# Altium schematic sheet flyback_circuit.SchDoc
size A
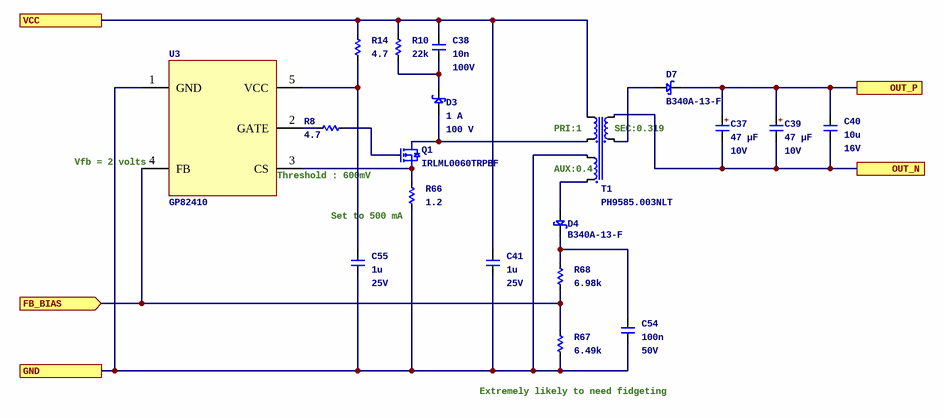
[diagram p0: flyback_circuit.SchDoc]

## Parts
C37  Capacitance: 47 µF  Voltage: 10V  [TANT_3.5MMX2.8MMX1.9MM]  (hidden comment: TAJB476M010RNJ)
C38  Capacitance: 10n  Voltage Rating: 100V  [C0603]  (hidden comment: CGA3EAC0G2A103JT000E)
C39  Capacitance: 47 µF  Voltage: 10V  [TANT_3.5MMX2.8MMX1.9MM]  (hidden comment: TAJB476M010RNJ)
C40  Capacitance: 10u  Voltage Rating: 16V  [C1206]  (hidden comment: CL31B106KOHNNNE)
C41  Capacitance: 1u  Voltage Rating: 25V  [C0603]  (hidden comment: CL10B105KA8NNNC)
C54  Capacitance: 100n  Voltage Rating: 50V  [C0402]  (hidden comment: CL05B104KB54PNC)
C55  Capacitance: 1u  Voltage Rating: 25V  [C0603]  (hidden comment: CL10B105KA8NNNC)
D3  Current: 1 A  Voltage: 100 V  [SOD123W]  (hidden comment: PMEG10010ELR-QX)
D4  B340A-13-F  [SMA]
D7  B340A-13-F  [SMA]
Q1  IRLML0060TRPBF  [3SOT23]
R8  value 4.7  [R0603]  (hidden comment: CRCW06034R70FKEAHP)
R10  value 22k  [R1206]  (hidden comment: ESR18EZPF2202)
R14  value 4.7  [R0603]  (hidden comment: CRCW06034R70FKEAHP)
R66  value 1.2  [R1206]  (hidden comment: HP06W2F120KT5E)
R67  value 6.49k  [R0402]  (hidden comment: 0402WGF6491TCE)
R68  value 6.98k  [R0402]  (hidden comment: RC0402FR-076K98L)
T1  PH9585.003NLT  [PULSE_PH9585]
U3  GP82410  [5SOT23]

## Ports
FB_BIAS (in), GND, OUT_N, OUT_P, VCC

## Nets
FB_BIAS: R67.2 R68.1 U3.4(FB) ; port FB_BIAS
GND: C41.2 C54.2 C55.2 R66.1 R67.1 T1.3 U3.1(GND) ; port GND
OUT_N: C37.2 C39.2 C40.2 T1.6 ; port OUT_N
OUT_P: C37.1 C39.1 C40.1 D7.2 ; port OUT_P
VCC: C38.1 C41.1 R10.2 R14.1 T1.1 ; port VCC
NetC38_2: C38.2 D3.2 R10.1
NetC54_1: C54.1 D4.2 R68.2
NetC55_1: C55.1 R14.2 U3.5(VCC)
NetD3_1: D3.1 Q1.3 T1.2
NetD4_1: D4.1 T1.4
NetD7_1: D7.1 T1.5
NetQ1_1: Q1.1 R8.1
NetQ1_2: Q1.2 R66.2 U3.3(CS)
NetR8_2: R8.2 U3.2(GATE)

## Notes on the sheet
- (near U3) Vfb = 2 volts
- (near U3) Threshold : 600mV
- (near R66) Set to 500 mA
- Extremely likely to need fidgeting
- (in symbol CAP_TANT_47UF_10V_TAJB476M010RNJ) +
- (in symbol TRANS_PULSE_PH9585.003NLT) PRI:1; SEC:0.319; AUX:0.4

## Library data of the parts
C37 C39 = CAP_TANT_47UF_10V_TAJB476M010RNJ: 47 µF Molded Tantalum Capacitors 10 V 1411 (3528 Metric), 1210 1Ohm; Manufacturer: KYOCERA AVX; Manufacturer Part Number: TAJB476M010RNJ; ComponentLink1URL: https://industrial.panasonic.com/cdbs/www-data/pdf/RDD0000/ABA0000C1234.pdf; ComponentLink1Description: Datasheet; Supplier 1: Digikey; Supplier Part Number 1: 478-3891-1-ND; Supplier 2: LCSC; Supplier Part Number 2: C8021
C38 = CGA3EAC0G2A103JT000E: Manufacturer: TDK; Dielectric: C0G; Manufacturer Part Number: CGA3EAC0G2A103JT000E; ComponentLink1URL: https://wmsc.lcsc.com/wmsc/upload/file/pdf/v2/lcsc/2304140030_TDK-CGA3EAC0G2A103JT000E_C342796.pdf; ComponentLink1Description: Datasheet; Package: 0603; Supplier 2: LCSC; Supplier Part Number 2: C342796
C40 = CL31B106KOHNNNE: Manufacturer: Samsung Electro-Mechanics; Dielectric: X7R; Manufacturer Part Number: CL31B106KOHNNNE; ComponentLink1URL: https://wmsc.lcsc.com/wmsc/upload/file/pdf/v2/lcsc/2304140030_Samsung-Electro-Mechanics-CL31B106KOHNNNE_C47971.pdf; ComponentLink1Description: Datasheet; Package: 1206; Supplier 2: LCSC; Supplier Part Number 2: C47971
C41 C55 = CL10B105KA8NNNC: Manufacturer: Samsung Electro-Mechanics; Dielectric: X7R; Manufacturer Part Number: CL10B105KA8NNNC; ComponentLink1URL: https://wmsc.lcsc.com/wmsc/upload/file/pdf/v2/lcsc/2304140030_Samsung-Electro-Mechanics-CL10B105KA8NNNC_C29936.pdf; ComponentLink1Description: Datasheet; Package: 0603; Supplier 2: LCSC; Supplier Part Number 2: C29936
C54 = CL05B104KB54PNC: Manufacturer: Samsung Electro-Mechanics; Dielectric: X7R; ComponentLink1URL: https://wmsc.lcsc.com/wmsc/upload/file/pdf/v2/lcsc/2304140030_Samsung-Electro-Mechanics-CL05B104KB54PNC_C307331.pdf; ComponentLink1Description: Datasheet; Manufacturer Part Number: CL05B104KB54PNC; Package: 0402; Supplier 2: LCSC; Supplier Part Number 2: C307331
D3 = SCHOTTKY_100V_PMEG10010ELR-QX: DIODE SCHOTTKY 100V 1A SOD123W; Manufacturer: Nexperia; Supplier 1: Digikey; Supplier Part Number 1: 1727-PMEG10010ELR-QXCT-ND; Manufacturer Part Number: PMEG10010ELR-QX; Supplier 2: LCSC; Supplier Part Number 2: C5361358; ComponentLink1Description: Datasheet; ComponentLink1URL: https://assets.nexperia.com/documents/data-sheet/PMEG10010ELR-Q.pdf
D4 D7 = SCHOTTKY_B340A-13-F: Rectifier Diode, Schottky, 1 Phase, 1 Element, 3A, 40V V(RRM), Silicon; Manufacturer: Diodes; Supplier 1: Digikey; Supplier Part Number 1: B340A-FDICT-ND; Manufacturer Part Number: B340A-13-F; ComponentLink1Description: Datasheet; ComponentLink1URL: https://www.diodes.com/assets/Datasheets/ds30891.pdf; Supplier 2: LCSC; Supplier Part Number 2: C85098
Q1 = NFET_60V_IRLML0060TRPBF: N-Channel 60 V 2.7A (Ta) 1.25W (Ta) Surface Mount Micro3™/SOT-23; Manufacturer: Infineon Technologies; Supplier 1: Digikey; Supplier Part Number 1: IRLML0060TRPBFCT-ND; Manufacturer Part Number: IRLML0060TRPBF; Supplier 2: LCSC; Supplier Part Number 2: C67274; ComponentLink1Description: Datasheet; ComponentLink1URL: https://www.infineon.com/assets/row/public/documents/24/49/infineon-irlml0060-ds-en.pdf
R8 R14 = CRCW06034R70FKEAHP: Manufacturer: Vishay Intertech; Tolerance: 1%; Temperature Coefficient: Â±100ppm/â„ƒ; Power Rating (mW): 333; Manufacturer Part Number: CRCW06034R70FKEAHP; ComponentLink1Description: Datasheet; ComponentLink1URL: https://wmsc.lcsc.com/wmsc/upload/file/pdf/v2/lcsc/2312110926_Vishay-Intertech-CRCW06034R70FKEAHP_C313771.pdf; Package: 0603; Supplier 2: LCSC; Supplier Part Number 2: C313771
R10 = ESR18EZPF2202: Manufacturer: ROHM Semicon; Tolerance: 1%; Temperature Coefficient: Â±100ppm/â„ƒ; Power Rating (mW): 500; Manufacturer Part Number: ESR18EZPF2202; ComponentLink1Description: Datasheet; ComponentLink1URL: https://datasheet.lcsc.com/lcsc/2304140030_ROHM-Semicon-ESR18EZPF2202_C2105413.pdf; Package: 1206; Supplier 2: LCSC; Supplier Part Number 2: C2105413
R66 = HP06W2F120KT5E: Manufacturer: UNI-ROYAL(Uniroyal Elec); Tolerance: 1%; Temperature Coefficient: Â±100ppm/â„ƒ; Power Rating (mW): 500; Manufacturer Part Number: HP06W2F120KT5E; ComponentLink1Description: Datasheet; ComponentLink1URL: https://wmsc.lcsc.com/wmsc/upload/file/pdf/v2/lcsc/2304140030_UNI-ROYAL-Uniroyal-Elec-HP06W2F120KT5E_C414958.pdf; Package: 1206; Supplier 2: LCSC; Supplier Part Number 2: C414958
R67 = 0402WGF6491TCE: Manufacturer: UNI-ROYAL(Uniroyal Elec); Tolerance: 1%; Temperature Coefficient: Â±100ppm/â„ƒ; Power Rating (mW): 62.5; Manufacturer Part Number: 0402WGF6491TCE; ComponentLink1Description: Datasheet; ComponentLink1URL: https://wmsc.lcsc.com/wmsc/upload/file/pdf/v2/lcsc/2411221126_UNI-ROYAL-Uniroyal-Elec-0402WGF6491TCE_C25916.pdf; Package: 0402; Supplier 2: LCSC; Supplier Part Number 2: C25916
R68 = RC0402FR-076K98L: Manufacturer: YAGEO; Tolerance: 1%; Temperature Coefficient: Â±100ppm/â„ƒ; Power Rating (mW): 62.5; Manufacturer Part Number: RC0402FR-076K98L; ComponentLink1Description: Datasheet; ComponentLink1URL: https://wmsc.lcsc.com/wmsc/upload/file/pdf/v2/lcsc/2304140030_YAGEO-RC0402FR-076K98L_C137944.pdf; Package: 0402; Supplier 2: LCSC; Supplier Part Number 2: C137944
T1 = TRANS_PULSE_PH9585.003NLT: Flyback Converters For SMPS Transformer 2250V Isolation 430kHz Surface Mount; Manufacturer: Pulse Electronics; Manufacturer Part Number: PH9585.003NLT; Supplier 1: Digikey; Supplier Part Number 1: 553-PH9585.003NLTCT-ND; ComponentLink1Description: Datasheet; ComponentLink1URL: https://yageogroup.com/content/datasheet/asset/file/DATASHEET_P858; Supplier 2: LCSC; Supplier Part Number 2: C17554365
U3 = FLYBACK_GP82410: 70kHz 300mV~31V SOT-23-5 AC-DC Controllers and Regulators ROHS / FLYBACK_GP82410; Manufacturer: Hanrun; Manufacturer Part Number: GP82410; ComponentLink1Description: Datasheet; ComponentLink1URL: https://lcsc.com/datasheet/lcsc_datasheet_2312081757_HaloChip-GP82410_C19626938.pdf; Supplier 1: LCSC; Supplier Part Number 1: C19626938